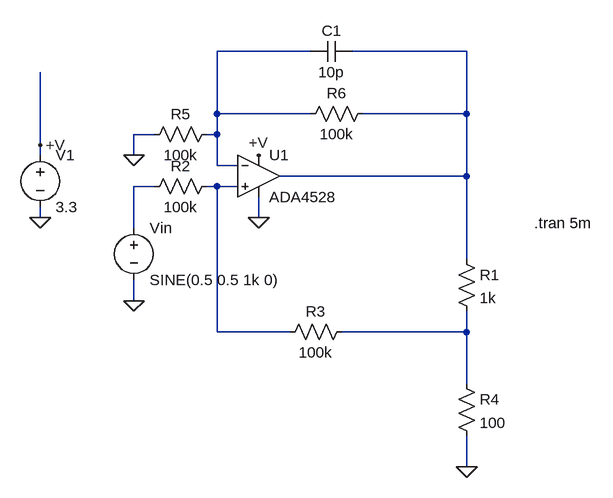
[diagram p0: schematic source.asc]
source.asc, the LTspice schematic file:
Version 4
SHEET 1 1388 700
WIRE 656 -1296 512 -1296
WIRE 896 -1296 720 -1296
WIRE 512 -1200 512 -1296
WIRE 656 -1200 512 -1200
WIRE 896 -1200 896 -1296
WIRE 896 -1200 736 -1200
WIRE 416 -1168 384 -1168
WIRE 512 -1168 512 -1200
WIRE 512 -1168 496 -1168
WIRE 240 -1152 240 -1264
WIRE 240 -1136 240 -1152
WIRE 384 -1136 384 -1168
WIRE 512 -1120 512 -1168
WIRE 544 -1120 512 -1120
WIRE 896 -1104 896 -1200
WIRE 896 -1104 608 -1104
WIRE 416 -1088 384 -1088
WIRE 512 -1088 496 -1088
WIRE 544 -1088 512 -1088
WIRE 240 -1040 240 -1056
WIRE 576 -1040 576 -1072
WIRE 384 -1024 384 -1088
WIRE 896 -976 896 -1104
WIRE 384 -912 384 -944
WIRE 512 -864 512 -1088
WIRE 624 -864 512 -864
WIRE 896 -864 896 -896
WIRE 896 -864 704 -864
WIRE 896 -784 896 -864
WIRE 896 -656 896 -704
FLAG 240 -1152 +V
FLAG 240 -1040 0
FLAG 576 -1136 +V
FLAG 576 -1040 0
FLAG 896 -656 0
FLAG 384 -912 0
FLAG 384 -1136 0
SYMBOL voltage 240 -1152 R0
WINDOW 123 0 0 Left 2
WINDOW 39 0 0 Left 2
SYMATTR InstName V1
SYMATTR Value 3.3
SYMBOL voltage 384 -1040 R0
WINDOW 123 24 146 Left 2
WINDOW 39 24 125 Left 2
SYMATTR InstName Vin
SYMATTR Value SINE(0.5 0.5 1k 0)
SYMBOL res 880 -992 R0
SYMATTR InstName R1
SYMATTR Value 1k
SYMBOL Opamps\\ADA4528 576 -1168 R0
SYMATTR InstName U1
SYMBOL res 512 -1104 R90
WINDOW 0 0 56 VBottom 2
WINDOW 3 32 56 VTop 2
SYMATTR InstName R2
SYMATTR Value 100k
SYMATTR SpiceLine tol=0.1
SYMBOL res 720 -880 R90
WINDOW 0 0 56 VBottom 2
WINDOW 3 32 56 VTop 2
SYMATTR InstName R3
SYMATTR Value 100k
SYMATTR SpiceLine tol=0.1
SYMBOL res 880 -800 R0
SYMATTR InstName R4
SYMATTR Value 100
SYMBOL res 512 -1184 R90
WINDOW 0 0 56 VBottom 2
WINDOW 3 32 56 VTop 2
SYMATTR InstName R5
SYMATTR Value 100k
SYMATTR SpiceLine tol=0.1
SYMBOL res 752 -1216 R90
WINDOW 0 0 56 VBottom 2
WINDOW 3 32 56 VTop 2
SYMATTR InstName R6
SYMATTR Value 100k
SYMATTR SpiceLine tol=0.1
SYMBOL cap 720 -1312 R90
WINDOW 0 0 32 VBottom 2
WINDOW 3 32 32 VTop 2
SYMATTR InstName C1
SYMATTR Value 10p
TEXT 1000 -1032 Left 2 !.tran 5m

The netlist it stands for:
* source.asc
V1 +V 0 3.3
Vin N003 0 SINE(0.5 0.5 1k 0)
R1 N002 N005 1k
XU1 N004 N001 +V 0 N002 ADA4528  ; pins In+ In- V+ V- OUT
R2 N004 N003 100k tol=0.1
R3 N005 N004 100k tol=0.1
R4 N005 0 100
R5 N001 0 100k tol=0.1
R6 N002 N001 100k tol=0.1
C1 N002 N001 10p
.tran 5m
.backanno
.end